# EAGLE design main (EAGLE 9.1.1)
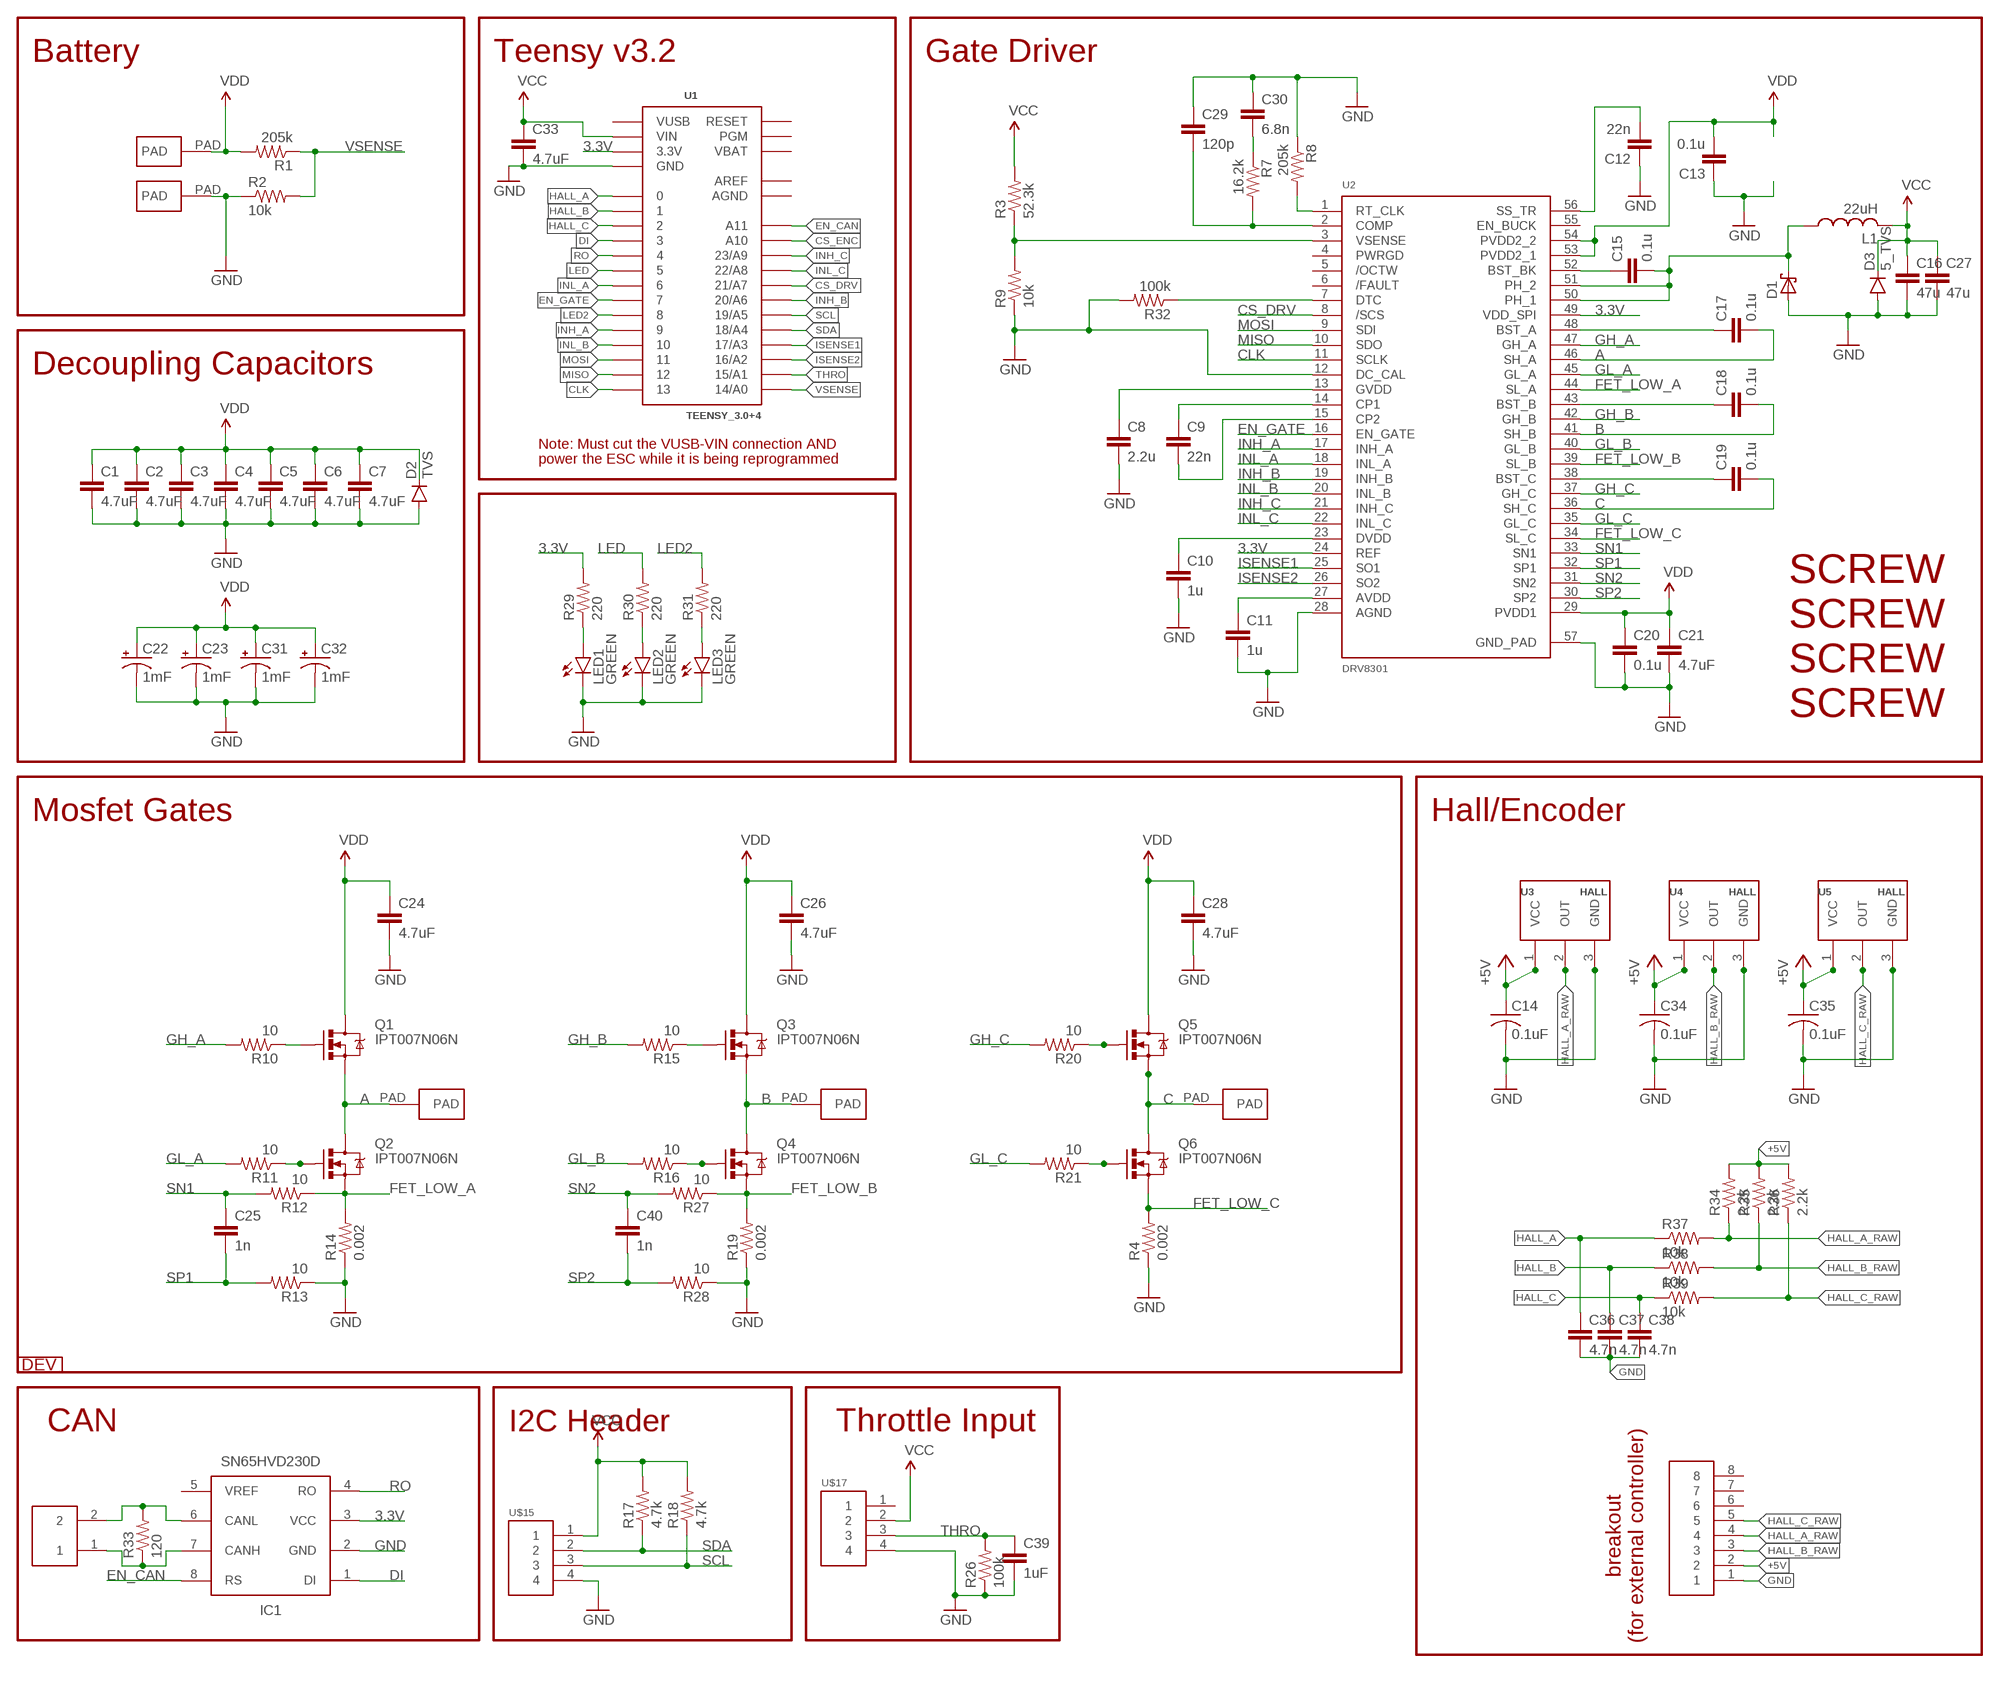
[diagram p0: schematic, sheet 1]

## Parts
C1  4.7uF  CAP1206  [1206]
C2  4.7uF  CAP1206  [1206]
C3  4.7uF  CAP1206  [1206]
C4  4.7uF  CAP1206  [1206]
C5  4.7uF  CAP1206  [1206]
C6  4.7uF  CAP1206  [1206]
C7  4.7uF  CAP1206  [1206]
C8  2.2u  CAP0603-CAP  [0603-CAP]
C9  22n  CAP0603-CAP  [0603-CAP]
C10  1u  CAP0603-CAP  [0603-CAP]
C11  1u  CAP0603-CAP  [0603-CAP]
C12  22n  CAP0603-CAP  [0603-CAP]
C13  0.1u  CAP0603-CAP  [0603-CAP]
C14  0.1uF  C-USC0603  [C0603]
C15  0.1u  CAP0603-CAP  [0603-CAP]
C16  47u  CAP0805  [0805]
C17  0.1u  CAP0603-CAP  [0603-CAP]
C18  0.1u  CAP0603-CAP  [0603-CAP]
C19  0.1u  CAP0603-CAP  [0603-CAP]
C20  0.1u  CAP0603-CAP  [0603-CAP]
C21  4.7uF  CAP1206  [1206]
C22  1mF  CAP_POLPTH4_3D  [CAPPRD508W65D1275H3100B]
C23  1mF  CAP_POLPTH4_3D  [CAPPRD508W65D1275H3100B]
C24  4.7uF  CAP1206  [1206]
C25  1n  CAP0603-CAP  [0603-CAP]
C26  4.7uF  CAP1206  [1206]
C27  47u  CAP0805  [0805]
C28  4.7uF  CAP1206  [1206]
C29  120p  CAP0603-CAP  [0603-CAP]
C30  6.8n  CAP0603-CAP  [0603-CAP]
C31  1mF  CAP_POLPTH4_3D  [CAPPRD508W65D1275H3100B]
C32  1mF  CAP_POLPTH4_3D  [CAPPRD508W65D1275H3100B]
C33  4.7uF  CAP1206  [1206]
C34  0.1uF  C-USC0603  [C0603]
C35  0.1uF  C-USC0603  [C0603]
C36  4.7n  CAP0603-CAP  [0603-CAP]
C37  4.7n  CAP0603-CAP  [0603-CAP]
C38  4.7n  CAP0603-CAP  [0603-CAP]
C39  1uF  CAP0603-CAP  [0603-CAP]
C40  1n  CAP0603-CAP  [0603-CAP]
CAN  HEADER2  [2PINVALULOK]
D1  SCHOTTKY_SMA  [SMA]
D2  TVS  DIODEES3J  [SMC]
D3  5_TVS  DIODESOT23  [SOT23-3]
IC1  SN65HVD230D  [SO-8]
L1  22uH  L-USL5650M  [L5650M]
LED1  GREEN  LED1206  [LED-1206]
LED2  GREEN  LED1206  [LED-1206]
LED3  GREEN  LED1206  [LED-1206]
Q1  IPT007N06N  MOSFET-NCHANNELPG-HSOF-8-1  [PG-HSOF-8-1]
Q2  IPT007N06N  MOSFET-NCHANNELPG-HSOF-8-1  [PG-HSOF-8-1]
Q3  IPT007N06N  MOSFET-NCHANNELPG-HSOF-8-1  [PG-HSOF-8-1]
Q4  IPT007N06N  MOSFET-NCHANNELPG-HSOF-8-1  [PG-HSOF-8-1]
Q5  IPT007N06N  MOSFET-NCHANNELPG-HSOF-8-1  [PG-HSOF-8-1]
Q6  IPT007N06N  MOSFET-NCHANNELPG-HSOF-8-1  [PG-HSOF-8-1]
R1  205k  RESISTOR0603-RES  [0603-RES]
R2  10k  RESISTOR0603-RES  [0603-RES]
R3  52.3k  RESISTOR0603-RES  [0603-RES]
R4  0.002  RESISTOR2512  [R2512]
R7  16.2k  RESISTOR0603-RES  [0603-RES]
R8  205k  RESISTOR0603-RES  [0603-RES]
R9  10k  RESISTOR0603-RES  [0603-RES]
R10  10  RESISTOR0603-RES  [0603-RES]
R11  10  RESISTOR0603-RES  [0603-RES]
R12  10  RESISTOR0603-RES  [0603-RES]
R13  10  RESISTOR0603-RES  [0603-RES]
R14  0.002  RESISTOR2512  [R2512]
R15  10  RESISTOR0603-RES  [0603-RES]
R16  10  RESISTOR0603-RES  [0603-RES]
R17  4.7k  RESISTOR0603-RES  [0603-RES]
R18  4.7k  RESISTOR0603-RES  [0603-RES]
R19  0.002  RESISTOR2512  [R2512]
R20  10  RESISTOR0603-RES  [0603-RES]
R21  10  RESISTOR0603-RES  [0603-RES]
R26  100k  RESISTOR0603-RES  [0603-RES]
R27  10  RESISTOR0603-RES  [0603-RES]
R28  10  RESISTOR0603-RES  [0603-RES]
R29  220  RESISTOR0603-RES  [0603-RES]
R30  220  RESISTOR0603-RES  [0603-RES]
R31  220  RESISTOR0603-RES  [0603-RES]
R32  100k  RESISTOR0603-RES  [0603-RES]
R33  120  RESISTOR0603-RES  [0603-RES]
R34  2.2k  RESISTOR0603-RES  [0603-RES]
R35  2.2k  RESISTOR0603-RES  [0603-RES]
R36  2.2k  RESISTOR0603-RES  [0603-RES]
R37  10k  RESISTOR0603-RES  [0603-RES]
R38  10k  RESISTOR0603-RES  [0603-RES]
R39  10k  RESISTOR0603-RES  [0603-RES]
U1  TEENSY_3.0+4  [TEENSY_3.0+4]
U2  DRV8301  [DRV8301]
U3  HALLSOT23W  [SOT23W]
U4  HALLSOT23W  [SOT23W]
U5  HALLSOT23W  [SOT23W]
U$15  HEADER4VALULOK  [4PINVALULOK]
U$16  DEV  [DEV]
U$17  HEADER4VALULOK  [4PINVALULOK]
U$19  SCREW  [M3HOLE]
U$20  SCREW  [M3HOLE]
U$21  SCREW  [M3HOLE]
U$22  SCREW  [M3HOLE]
U$23  PAD  [PAD]
U$24  PAD  [PAD]
U$25  PAD  [PAD]
U$26  PAD  [PAD]
U$27  PAD  [PAD]
U$29  HEADER8  [8PINVALULOK]

## Nets
3.3V: IC1.3(VCC) R29.2 U1.3.3V U1.3.3V1(3.3V) U2.24(REF) U2.49(VDD_SPI)
+5V: C14.1 C34.1 C35.1 R34.2 R35.2 R36.2 U3.1(VCC) U4.1(VCC) U5.1(VCC) U$29.2
A: C17.2 Q1.S Q2.D U2.46(SH_A) U$23.PAD
B: C18.2 Q3.S Q4.D U2.41(SH_B) U$24.PAD
C: C19.2 Q5.S Q6.D U2.36(SH_C) U$25.PAD
CANH: CAN.1 IC1.7(CANH) R33.1
CANL: CAN.2 IC1.6(CANL) R33.2
CLK: U1.13 U2.11(SCLK)
CS_DRV: U1.21/A7 U2.8(/SCS)
CS_ENC: U1.A10
DI: IC1.1(DI) U1.3
EN_CAN: IC1.8(RS) U1.A11
EN_GATE: U1.7 U2.16(EN_GATE)
FET_LOW_A: Q2.S R12.1 R14.2 U2.44(SL_A)
FET_LOW_B: Q4.S R19.2 R27.1 U2.39(SL_B)
FET_LOW_C: Q6.S R4.2 U2.34(SL_C)
GH_A: R10.2 U2.47(GH_A)
GH_B: R15.2 U2.42(GH_B)
GH_C: R20.2 U2.37(GH_C)
GL_A: R11.2 U2.45(GL_A)
GL_A': Q2.G R11.1
GL_B: R16.2 U2.40(GL_B)
GL_B': Q4.G R16.1
GL_C: R21.2 U2.35(GL_C)
GL_C': Q6.G R21.1
GND: C1.2 C2.2 C3.2 C4.2 C5.2 C6.2 C7.2 C8.2 C10.2 C11.2 C12.1 C13.1 C14.2 C16.2 C20.2 C21.2 C22.- C23.- C24.2 C26.2 C27.2 C28.2 C29.1 C30.1 C31.- C32.- C33.2 C34.2 C35.2 C36.2 C37.2 C38.2 C39.2 D1.A D2.A D3.1(A) IC1.2(GND) LED1.C LED2.C LED3.C R2.1 R4.1 R8.1 R9.1 R13.1 R14.1 R19.1 R26.1 R28.1 R32.2 U1.GND U1.GND1(GND) U2.12(DC_CAL) U2.28(AGND) U2.57(GND_PAD) U3.3(GND) U4.3(GND) U5.3(GND) U$15.4 U$17.4 U$27.PAD U$29.1
HALL_A: C36.1 R37.1 U1.0
HALL_A_RAW: R34.1 R37.2 U3.2(OUT) U$29.4
HALL_B: C37.1 R38.1 U1.1
HALL_B_RAW: R35.1 R38.2 U4.2(OUT) U$29.3
HALL_C: C38.1 R39.1 U1.2
HALL_C_RAW: R36.1 R39.2 U5.2(OUT) U$29.5
INH_A: U1.9 U2.17(INH_A)
INH_B: U1.20/A6 U2.19(INH_B)
INH_C: U1.23/A9 U2.21(INH_C)
INL_A: U1.6 U2.18(INL_A)
INL_B: U1.10 U2.20(INL_B)
INL_C: U1.22/A8 U2.22(INL_C)
ISENSE1: U1.17/A3 U2.25(SO1)
ISENSE2: U1.16/A2 U2.26(SO2)
LED: R30.2 U1.5
LED2: R31.2 U1.8
MISO: U1.12 U2.10(SDO)
MOSI: U1.11 U2.9(SDI)
N$1: Q3.G R15.1
N$2: R3.1 R9.2 U2.3(VSENSE)
N$3: C29.2 R7.2 U2.2(COMP)
N$4: C10.1 U2.23(DVDD)
N$5: Q5.G R20.1
N$6: C12.2 U2.56(SS_TR)
N$7: C30.2 R7.1
N$8: C15.1 U2.52(BST_BK)
N$9: Q1.G R10.1
N$10: R8.2 U2.1(RT_CLK)
N$11: LED1.A R29.1
N$12: R32.1 U2.7(DTC)
N$16: LED2.A R30.1
N$17: LED3.A R31.1
N$28: C19.1 U2.38(BST_C)
N$30: C9.1 U2.14(CP1)
N$31: C11.1 U2.27(AVDD)
N$32: C9.2 U2.15(CP2)
N$33: C8.1 U2.13(GVDD)
N$34: C18.1 U2.43(BST_B)
N$44: C17.1 U2.48(BST_A)
N$47: C15.2 D1.C L1.1 U2.50(PH_1) U2.51(PH_2)
RO: IC1.4(RO) U1.4
SCL: R18.1 U1.19/A5 U$15.3
SDA: R17.1 U1.18/A4 U$15.2
SN1: C25.1 R12.2 U2.33(SN1)
SN2: C40.1 R27.2 U2.31(SN2)
SP1: C25.2 R13.2 U2.32(SP1)
SP2: C40.2 R28.2 U2.30(SP2)
THRO: C39.1 R26.2 U1.15/A1 U$17.3
VCC: C16.1 C27.1 C33.1 D3.3(C) L1.2 R3.2 R17.2 R18.2 U1.VIN U$15.1 U$17.2
VDD: C1.1 C2.1 C3.1 C4.1 C5.1 C6.1 C7.1 C13.2 C20.1 C21.1 C22.+ C23.+ C24.1 C26.1 C28.1 C31.+ C32.+ D2.C Q1.D Q3.D Q5.D R1.2 U2.29(PVDD1) U2.53(PVDD2_1) U2.54(PVDD2_2) U$26.PAD
VSENSE: R1.1 R2.2 U1.14/A0
Unconnected: IC1.5(VREF) U1.PGM U1.RESET U2.4(PWRGD) U2.5(/OCTW) U2.6(/FAULT) U2.55(EN_BUCK) U$17.1 U$29.6 U$29.7 U$29.8

## Notes on the sheet
- Battery | Teensy v3.2 | Gate Driver
- Decoupling Capacitors
- Note: Must cut the VUSB-VIN connection AND
- power the ESC while it is being reprogrammed
- Mosfet Gates | Hall/Encoder
- CAN | I2C Header | Throttle Input
- breakout
  (for external controller)

## Power pins joined to a net without a drawn wire
AGND: U1.AGND
AREF: U1.AREF
VBAT: U1.VBAT
VUSB: U1.VUSB

## Library data of the parts
C1-C7 C10 C11 C16 C21 C24 C26-C28 C33 = SparkFun-Capacitors:CAP: Capacitor Standard 0603 ceramic capacitor, and 0.1" leaded capacitor.
C8 C9 C12 C13 C15 C17-C20 C25 C29 C30 C36-C40 = SparkFun-Passives:CAP: Capacitor Standard 0603 ceramic capacitor, and 0.1" leaded capacitor.
C14 C34 C35 = rcl:C-US: CAPACITOR, American symbol
C22 C23 C31 C32 = SparkFun-Capacitors:CAP_POL: Capacitor Polarized These are standard SMD and PTH capacitors. Normally 10uF, 47uF, and 100uF in electrolytic and tantalum varieties. Always verify the external diameter of the through hole cap, it varies with capacity, voltage, and manufacturer. The EIA devices should be standard.
CAN = Custom_old:HEADER2
D1 = sc_usercreated:SCHOTTKY_SMA
D2 = SparkFun-DiscreteSemi:DIODE: Diode These are standard reverse protection diodes and small signal diodes. SMA package can handle up to about 1A. SOD-323 can handle about 200mA. What the SOD-323 package when ordering, there are some mfgs out there that are 5-pin packages.; PROD_ID: DIO-12441; VALUE: 3A/600V
D3 = SparkFun-DiscreteSemi:DIODE: Diode These are standard reverse protection diodes and small signal diodes. SMA package can handle up to about 1A. SOD-323 can handle about 200mA. What the SOD-323 package when ordering, there are some mfgs out there that are 5-pin packages.
IC1 = Misaka-IC:SN65HVD23*D: 3.3V CAN Bus Transceiver Supply voltage: 3...3.6V Max rate: 1Mbps Standby mode(SN65HVD230D) Sleep mode(SN65HVD231D) Slope control mode
L1 = rcl:L-US: INDUCTOR, American symbol; SPICEPREFIX: L
LED1-LED3 = SparkFun-LED:LED: LEDs Standard schematic elements and footprints for 5mm, 3mm, 1206, and 0603 sized LEDs. 5mm - Spark Fun Electronics SKU : COM-00529 (and others)
Q1-Q6 = Custom_old:MOSFET-NCHANNEL: Generic NMOS footprint
R1-R3 R7-R13 R15-R18 R20 R21 R26-R39 = SparkFun-Passives:RESISTOR: Resistor Basic schematic elements and footprints for 0603, 1206, and PTH resistors.
R4 R14 R19 = SparkFun-Resistors:RESISTOR: Resistor Basic schematic elements and footprints for 0603, 1206, and PTH resistors.
U1 = Teensy3.0:TEENSY_3.0+4: Teensy 3.0 board, showing all pins that are easily acessible. See 'AllAnalogPins" and 'AllPins' packages for additional pin holes, as needed. The 'Basic' package has fewer pins.
U2 = F-J:DRV8301
U3-U5 = Custom_new:HALL
U$15 U$17 = Custom_old:HEADER4
U$16 = F-J:DEV
U$19-U$22 = Custom_old:SCREW
U$23-U$27 = Custom_old:PAD
U$29 = Custom_old:HEADER8

## Module 2/2
Ports: 

### Library data of the parts

## Board
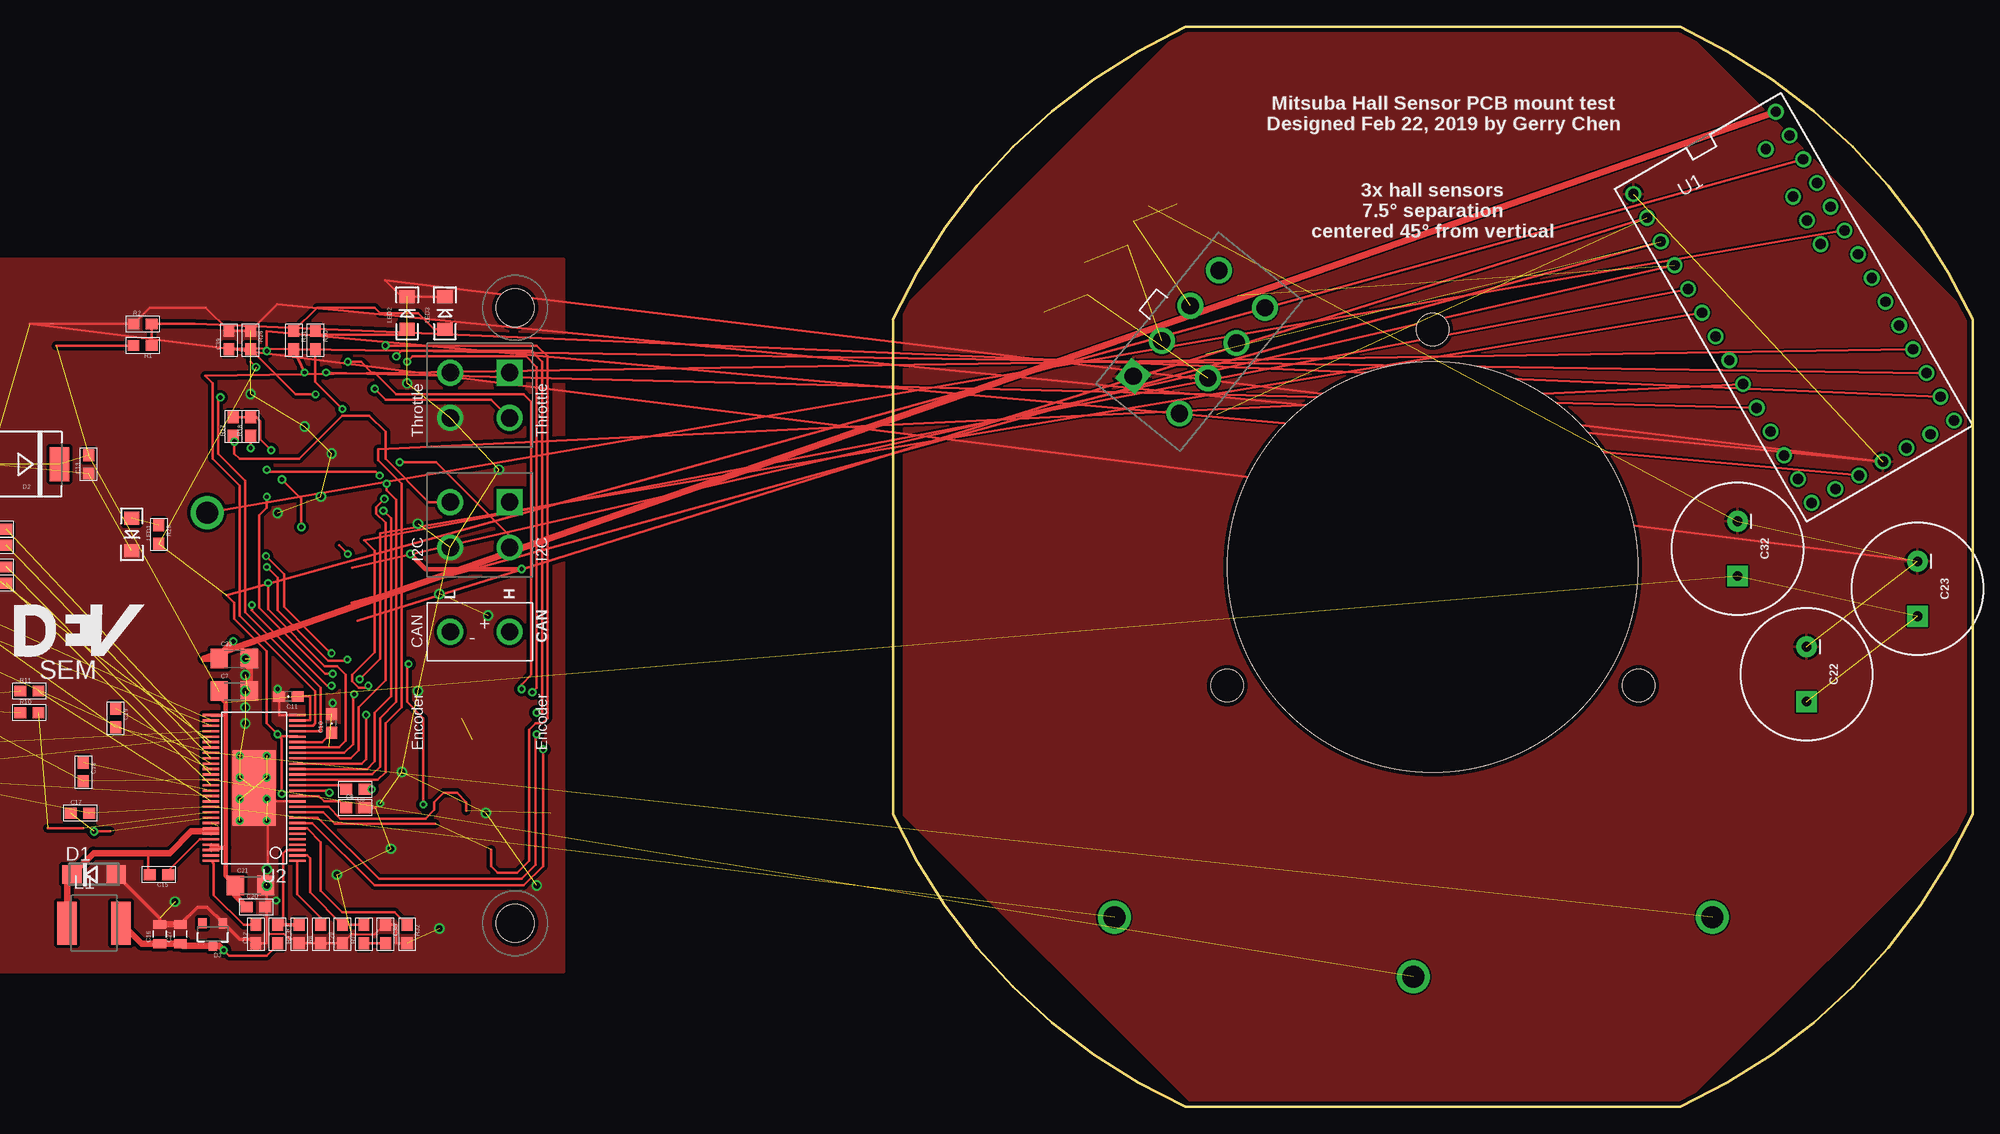
[diagram p1: board, top side]
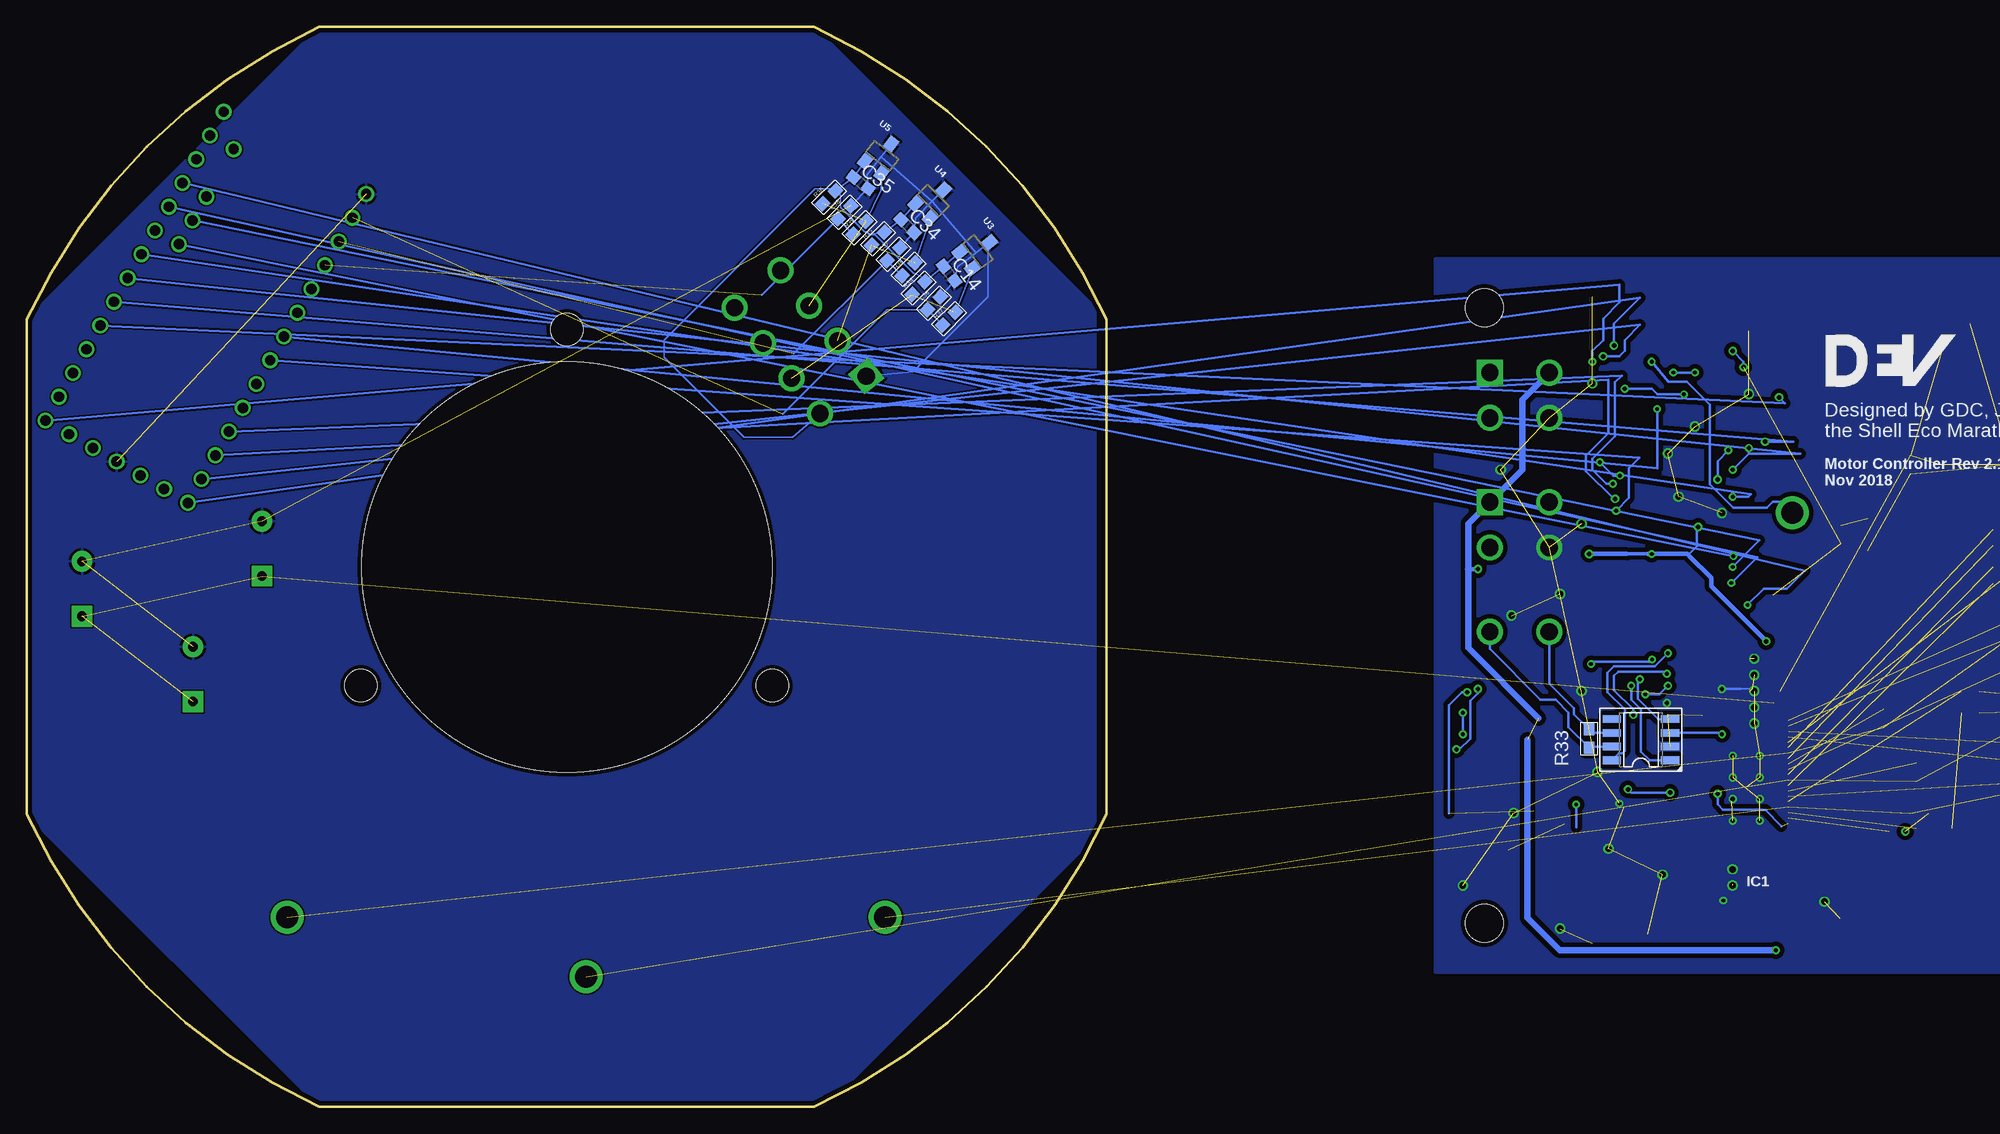
[diagram p2: board, bottom side, seen from below]

Size 100 x 100 mm. Coordinates in mm from the lower left corner, seen from the top.
Outline: 72.91,100 27.09,100 arc41 0,72.91 0,27.09 arc41 27.09,0 72.91,0 arc41 100,27.09 100,72.91 arc41 72.91,100
Copper layers (1*16): Top 0.0356mm / dielectric 1.5011mm / Bottom 0.0356mm
Design rules "patrick *": minimum track width 6mil, minimum drill 13mil, track to track 6mil, track to pad 6mil, pad to pad 6mil, via to via 6mil, smd to smd 6mil, copper to edge 15mil, drill to drill 6mil, minimum pad ring 7mil, minimum via ring 7mil, stop-mask expansion 3mil, vias tented up to drill 30mil, thermal gap 10mil
Holes 3 mm at 30.95,39 69.05,39 50,72
Holes 38 mm at 50,50

### Footprints (pad centres in the part's own frame; a part is rotated, then mirrored left to right if it is on the bottom)
1206 = smd 1.6 x 1.8: 1 -1.4,0; 2 1.4,0
0603-CAP = smd 1.1 x 1: 1 -0.85,0; 2 0.85,0
C0603 = smd 1.1 x 1: 1 -0.85,0; 2 0.85,0
0805 = smd 0.8 x 1.2: 1 -0.9,0; 2 0.9,0
CAPPRD508W65D1275H3100B = drill 0.9 pad 1.93 square: + 2.54,0 | drill 0.9 pad 1.93: - -2.54,0
2PINVALULOK = drill 1.6: 1 0,5.5; 2 0,0
SMA = smd 1.8 x 1.7: A 2.05,0; C -2.05,0
SMC = smd 1.778 x 3.175: A 3.302,0; C -3.302,0
SOT23-3 = smd 0.8 x 0.9: 1 -0.95,-1; 2 0.95,-1; 3 0,1.1
SO-8 = smd 1.7 x 0.7: 1 -2.7,1.905; 2 -2.7,0.635; 3 -2.7,-0.635; 4 -2.7,-1.905; 5 2.7,-1.905; 6 2.7,-0.635; 7 2.7,0.635; 8 2.7,1.905
L5650M = smd 1.8 x 4: 1 -2.5,0; 2 2.5,0
LED-1206 = smd 1.2 x 1.4: A -1.5,0; C 1.5,0
PG-HSOF-8-1 = smd 7.5 x 7.65: D 0,8.855 | smd 0.8 x 3: G -4.2,0.5 | smd 8 x 3: S 0.6,0.5
0603-RES = smd 1.1 x 1: 1 -0.85,0; 2 0.85,0
R2512 = smd 1.8 x 3.2: 1 -2.8,0; 2 2.8,0
TEENSY_3.0+4 = drill 0.965: 0 -7.62,13.97; 1 -7.62,11.43; 2 -7.62,8.89; 3 -7.62,6.35; 3.3V 7.62,11.43; 3.3V1 -2.54,-16.51; 4 -7.62,3.81; 5 -7.62,1.27; 6 -7.62,-1.27; 7 -7.62,-3.81; 8 -7.62,-6.35; 9 -7.62,-8.89; 10 -7.62,-11.43; 11 -7.62,-13.97; 12 -7.62,-16.51; 13 7.62,-16.51; 14/A0 7.62,-13.97; 15/A1 7.62,-11.43; 16/A2 7.62,-8.89; 17/A3 7.62,-6.35; 18/A4 7.62,-3.81; 19/A5 7.62,-1.27; 20/A6 7.62,1.27; 21/A7 7.62,3.81; 22/A8 7.62,6.35; 23/A9 7.62,8.89; A10 5.08,6.35; A11 5.08,3.81; AGND 7.62,13.97; AREF 5.08,8.89; GND -7.62,16.51; GND1 0,-16.51; PGM 2.54,-16.51; RESET 5.08,-16.51; VBAT -5.08,-16.51; VIN 7.62,16.51; VUSB 5.08,13.97
DRV8301 = smd 1.5 x 0.21: 1 -4,6.75; 2 -4,6.25; 3 -4,5.75; 4 -4,5.25; 5 -4,4.75; 6 -4,4.25; 7 -4,3.75; 8 -4,3.25; 9 -4,2.75; 10 -4,2.25; 11 -4,1.75; 12 -4,1.25; 13 -4,0.75; 14 -4,0.25; 15 -4,-0.25; 16 -4,-0.75; 17 -4,-1.25; 18 -4,-1.75; 19 -4,-2.25; 20 -4,-2.75; 21 -4,-3.25; 22 -4,-3.75; 23 -4,-4.25; 24 -4,-4.75; 25 -4,-5.25; 26 -4,-5.75; 27 -4,-6.25; 28 -4,-6.75; 29 4,-6.75; 30 4,-6.25; 31 4,-5.75; 32 4,-5.25; 33 4,-4.75; 34 4,-4.25; 35 4,-3.75; 36 4,-3.25; 37 4,-2.75; 38 4,-2.25; 39 4,-1.75; 40 4,-1.25; 41 4,-0.75; 42 4,-0.25; 43 4,0.25; 44 4,0.75; 45 4,1.25; 46 4,1.75; 47 4,2.25; 48 4,2.75; 49 4,3.25; 50 4,3.75; 51 4,4.25; 52 4,4.75; 53 4,5.25; 54 4,5.75; 55 4,6.25; 56 4,6.75 | smd 4 x 7: 57 0,0
SOT23W = smd 1 x 1.4: 1 -0.95,-1.303; 2 0.95,-1.303; 3 0,1.303
4PINVALULOK = drill 1.6 square: 1 0,5.5 | drill 1.6: 2 0,0; 3 4.2,5.5; 4 4.2,0
M3HOLE = hole 3.5: 0,0
PAD = smd 10.16 x 5.08: PAD 0,0
8PINVALULOK = drill 1.6 square: 1 0,5.5 | drill 1.6: 2 0,0; 3 4.2,5.5; 4 4.2,0; 5 8.4,5.5; 6 8.4,0; 7 12.6,5.5; 8 12.6,0

### Placement (x,y rotation side)
C1  -89,47.5 0 top  (outside the outline)
C2  -89,59.5 0 top  (outside the outline)
C3  -89,54.5 0 top  (outside the outline)
C4  -89,35.5 0 top  (outside the outline)
C5  -89,45 0 top  (outside the outline)
C6  -89,30.5 0 top  (outside the outline)
C7  -61,38.5 0 top  (outside the outline)
C8  -49.8,27.7 0 top  (outside the outline)
C9  -49.8,29.4 180 top  (outside the outline)
C10  -52,35.5 90 top  (outside the outline)
C11  -56,38 180 top  (outside the outline)
C12  -59,16 90 top  (outside the outline)
C13  -74.5,59.5 90 top  (outside the outline)
C14  14.58,77.18 307.5 bottom
C15  -68,21.5 180 top  (outside the outline)
C16  -67.9,16 90 top  (outside the outline)
C17  -75.3,27.2 0 top  (outside the outline)
C18  -75,31 270 top  (outside the outline)
C19  -72,36 270 top  (outside the outline)
C20  -59,18.5 0 top  (outside the outline)
C21  -59.5,20.5 0 top  (outside the outline)
C22  84.63,40.07 270 top
C23  94.9,47.97 270 top
C24  -89,57 0 top  (outside the outline)
C25  -85,32.8 90 top  (outside the outline)
C26  -89,42.5 0 top  (outside the outline)
C27  -66,16 90 top  (outside the outline)
C28  -89,33 0 top  (outside the outline)
C29  -51,16 90 top  (outside the outline)
C30  -47,16 270 top  (outside the outline)
C31  -100,20 90 top  (outside the outline)
C32  78.23,51.7 270 top
C33  -61,41.5 0 top  (outside the outline)
C34  18.43,81.57 315 bottom
C35  22.78,85.57 322.5 bottom
C36  16,74.41 45 bottom
C37  19.74,78.97 45 bottom
C38  24.29,82.83 45 bottom
C39  -61.5,71 90 top  (outside the outline)
C40  -85.38,44.97 90 top  (outside the outline)
CAN  -41,44 270 top  (outside the outline)
D1  -74,21.5 0 top  (outside the outline)
D2  -80.5,59.5 180 top  (outside the outline)
D3  -63,16 180 top  (outside the outline)
IC1  -49.5,34 180 bottom  (outside the outline)
L1  -74,17 0 top  (outside the outline)
LED1  -70.5,53 270 top  (outside the outline)
LED2  -45,73.5 90 top  (outside the outline)
LED3  -41.5,73.5 90 top  (outside the outline)
Q1  -105,33 270 top  (outside the outline)
Q2  -94,33 270 bottom  (outside the outline)
Q3  -105,45 270 top  (outside the outline)
Q4  -94,45 270 bottom  (outside the outline)
Q5  -105,57 270 top  (outside the outline)
Q6  -94,57 270 bottom  (outside the outline)
R1  -69.5,70.5 180 top  (outside the outline)
R2  -69.5,72.5 0 top  (outside the outline)
R3  -57,16 270 top  (outside the outline)
R4  -90,57 270 bottom  (outside the outline)
R7  -49,16 90 top  (outside the outline)
R8  -53,16 90 top  (outside the outline)
R9  -55,16 90 top  (outside the outline)
R10  -80,36.5 0 top  (outside the outline)
R11  -80,38.5 0 top  (outside the outline)
R12  -86.5,31 90 bottom  (outside the outline)
R13  -86.5,34.5 270 bottom  (outside the outline)
R14  -90,33 270 bottom  (outside the outline)
R15  -83,48.5 0 top  (outside the outline)
R16  -83,50 0 top  (outside the outline)
R17  -61.1,63 90 top  (outside the outline)
R18  -59.5,63 90 top  (outside the outline)
R19  -90,45 270 bottom  (outside the outline)
R20  -83,52 0 top  (outside the outline)
R21  -83,53.5 0 top  (outside the outline)
R26  -59.5,71 270 top  (outside the outline)
R27  -87,43 90 bottom  (outside the outline)
R28  -87,46.5 270 bottom  (outside the outline)
R29  -68,53 270 top  (outside the outline)
R30  -53.5,71 270 top  (outside the outline)
R31  -55.5,71 270 top  (outside the outline)
R32  -45,16 270 top  (outside the outline)
R33  -44.7,34.1 90 bottom  (outside the outline)
R34  17.41,75.83 45 bottom
R35  21.16,80.39 45 bottom
R36  25.7,84.24 45 bottom
R37  14.59,73 45 bottom
R38  18.33,77.56 45 bottom
R39  22.87,81.41 45 bottom
U1  83.44,74.04 30 top
U2  -59.17,29.53 180 top  (outside the outline)
U3  11.92,79.22 307.5 bottom
U4  16.06,83.94 315 bottom
U5  20.78,88.08 322.5 bottom
U$15  -41,56 270 top  (outside the outline)
U$16  -81.35,41.74 0 top  (outside the outline)
U$17  -41,68 270 top  (outside the outline)
U$19  -112,17 0 top  (outside the outline)
U$20  -35,17 0 top  (outside the outline)
U$21  -112,74 0 top  (outside the outline)
U$22  -35,74 0 top  (outside the outline)
U$23  -111,33 90 top  (outside the outline)
U$24  -111,45 90 top  (outside the outline)
U$25  -111,57 90 top  (outside the outline)
U$26  -108,67 0 top  (outside the outline)
U$27  -108,67 0 bottom  (outside the outline)
U$28  DEV  [DEV]  -66.65,66.74 0 bottom  (outside the outline)
U$29  26.53,64.2 51 top
U$30  [DEV]  7,60 0 top
U$31  [DEV]  79,51 0 top

### Tracks (layer width: path | path; a pad name or v marks a point on that pad's centre or on a via)
3.3V  (via drill 0.35, 0.4)  (3 unrouted)
  Top 0.254: U2.24 -55.19,34.3 -56.8,34.3 | -56.8,34.3 v-57,34.5 -58,35.5 -58,42.2 -61,45.2 -61,46.7 -61.7,47.4 U1.3.3V | -56.8,34.3 -56.6,34.1 v-56.6,29 | U1.3.3V1 -58,71.84 v-58,70 | v-59,68.5 -59.5,69
  Bottom 0.254: -62.5,26 -61,27.5 -57.1,27.5 -56.6,28 v-56.6,29 | v-58,70 -59,69 v-59,68.5 | IC1.3 -56.86,34.63 v-57,34.5
+5V
  Bottom 0.152: U3.1 C14.1 16.64,76.57 | 16.64,76.57 R34.2 | U4.1 C34.1 R35.2 21.98,80.8 | U5.1 C35.1 R36.2 | R36.2 24.66,84.4 24.66,83.3 22.4,81.05 22.25,81.05 22,80.8 21.98,80.8 | 21.98,80.8 21.93,80.76 21.43,80.76 17.86,77.19 17.8,77.19 16.64,76.57 | U$29.2 29.09,62 33.59,62 41,69.41 41,71 27,85 25.25,85 R36.2
A  (via drill 2.03)  (4 unrouted)
  other vias: 20.5,17.54
  pour Top (isolate 0.254, no thermals): -114,28 -114,38 -108,38 -106,36 -101,36 -101,28
B  (via drill 2.03)  (4 unrouted)
  other vias: 48.2,12.04
  pour Top (isolate 0.254, no thermals): -114,50 -114,40 -101,40 -101,48 -106,48 -108,50
C  (via drill 2.03)  (4 unrouted)
  other vias: 75.9,17.54
  pour Top (isolate 0.254, no thermals): -114,62 -114,52 -101,52 -101,60 -106,60 -108,62
CANH
  Bottom 0.254: IC1.7 -44.81,33.36 R33.1 -42.8,35.15 -42.8,36.5 -41.6,37.7 -40.2,37.7 -35.5,42.4 CAN.1
CANL
  Bottom 0.254: IC1.6 -45.02,34.63 R33.2 -43.3,36.35 -43.3,36.9 -41,39.2 CAN.2
CLK  (via drill 0.4)  (1 unrouted)
  Top 0.254: v-45,69 -44.5,69.5 -34,69.5 -33,68.5 -33,38.8 v-33.4,38.4 | U2.11 -52.28,27.78 -51.2,26.7 -43.3,26.7 -42.48,27.52 -42.48,28.21 -41.61,29.08 -40.39,29.08 -39.52,28.21 -39.52,27.42
  Bottom 0.254: U1.13 -47.5,76.15 -47.5,74.5 -46,73 -46,71 -45,70 v-45,69 | -31.7,27.2 -31.7,37.2 -32.9,38.4 v-33.4,38.4
CS_DRV  (via drill 0.35, 0.4, 2.03)
  Top 0.254: U2.8 -53.78,26.28 -48,20.5 -34.2,20.5 -32.4,22.3 v-32.4,33.1 | U1.21/A7 v-63.54,55.02 | v-50.5,69 -49.28,69 -48.28,68 -48,68 -46,66 -34.2,66 -33.5,65.3 -33.5,40 -34.4,39.1 v-34.4,38.7
  Bottom 0.254: v-63.54,55.02 -62.53,56.02 -61.7,56.02 -61.18,55.5 -58.07,55.5 -55.9,57.67 -55.9,65.03 -53.77,67.16 -52.02,67.16 v-50.5,69 | v-34.4,38.7 -34.4,38.3 -33.7,37.6 -33.7,34.1 -32.7,33.1 v-32.4,33.1
CS_ENC  (via drill 0.35)
  Top 0.254: v-58,50 -57,49 -57,46 -52.3,41.3 -50.67,41.3 v-50.54,41.43 | v-43.5,28 -43.5,36 -45,37.5 -45,40.87 v-44.87,41
  Bottom 0.254: U1.A10 -60.48,52.48 v-58,50 | -43.5,25.9 v-43.5,28 | v-44.87,41 -45.07,41.21 -50.33,41.21 -50.54,41.42 v-50.54,41.43
DI  (via drill 0.35)
  Top 0.254: U1.3 -48.98,52.48 -48,51.5 -48,42.1 -50.1,40 -50.1,39.4 -49.5,38.8 -48.8,38.8 v-48.6,39
  Bottom 0.254: v-48.6,39 -48.6,37.7 -49.5,36.8 -49.5,32.9 -50.31,32.09 IC1.1
EN_CAN  (via drill 0.35)
  Top 0.254: v-58.07,51 -56.4,49.33 -56.4,46.3 -52.1,42 v-52,42
  Bottom 0.254: U1.A11 -58.1,51 v-58.07,51 | IC1.8 -47.44,32.74 -47.77,32.74 -48,32.97 -48,36.8 -46.4,38.4 -46.4,40.2 -47,40.8 -50.8,40.8 v-52,42
EN_GATE
  Top 0.254: U2.16 -47.72,30.28 -47,31 -47,35.5 -45.5,37 -45.5,57.7 -47.7,59.9 -47.7,60.92 U1.7
FET_LOW_A  (3 unrouted)
  pour Bottom (isolate 0.254, no thermals): -96,36.5 -96,28.5 -93,32.5 -93,36.5
FET_LOW_B  (3 unrouted)
FET_LOW_C  (2 unrouted)
  pour Bottom (isolate 0.254, no thermals): -96,60 -96,53 -93,56 -93,60
GH_A  (2 unrouted)
  Top 0.254: -78.3,25.8 -75,25.8
GH_B  (1 unrouted)
GH_C  (1 unrouted)
GL_A  (1 unrouted)
GL_A'  (1 unrouted)
GL_B  (1 unrouted)
GL_B'  (1 unrouted)
GL_C  (1 unrouted)
GL_C'  (1 unrouted)
GND  (via drill 0.35, 0.4, 0.6)  (61 unrouted)
  Top 0.2: -50,16 -48,16 | R9.1 -55.35,15.5 -55.9,15.5 -56.4,16 -58,16
  Top 0.254: U2.12 -57.78,28.28 | -57.78,28.28 -57.92,28.28 | -57.92,28.28 U2.57 | -57.92,28.28 -57.92,20.68 C21.2 | C12.1 -58,15.15 -58,16 -58,18.5 | -58,18.5 -58,19 | -58,19 -58,20 -58.1,20 C21.2 | LED3.C LED2.C -45.5,75 -47.04,76.54 U1.GND1 -57.04,74.31 R26.1 C39.2 -63.65,74 -68.85,74 R2.1 -79.96,72.5 C23.- | C10.2 -52,37.3 v-51.9,37.4 | U2.28 -56.85,36.28 C11.2 -57,38 v-57,38.7 | R9.1 R8.1 C29.1 -50.15,16 -50,16 | R32.2 -46,15.15 -46,16.85 C30.1 -47.15,16.85 -48,16 | C20.2 -58,18.5 | v-58,28.5 -57.78,28.28 | C8.2 -47.9,27.7 v-47.5,28.1 | -58,19 -57.9,19.1 v-57.13,19.1 | C21.2 -58,20.6 v-58,22
  Top 0.305: D1.A -67.9,17.45 C16.2 | C27.2 -64.4,18.5 -63.5,18.5 -62.05,17.05 D3.1 -62,17 -60.5,15.5 -59.35,15.5 C12.1
  Top 0.61: C16.2 C27.2 | C33.2 C7.2
  Bottom 0.152: -58.7,38.7 -59.8,38.7 v-60,38.5 | U3.3 10.96,79.95 | 10.96,79.95 12.08,79.1 | 12.08,79.1 12.6,78.7 13.8,77.8 C14.2 C36.2 | C38.2 C35.2 22.2,86.3 20.88,87.98 | C37.2 C34.2 17.7,82.3 16.15,83.85 | U4.3 16.15,83.85 | U5.3 20.88,87.98 | 12.08,79.1 16.15,83.85 | 16.15,83.85 20.88,87.98 | U$29.1 17.92,68.08 10.96,75.04 10.96,79.95
  Bottom 0.254: v-57,38.7 -58.7,38.7
  other vias: -60.5,32.5 -60.5,30.5 -60.5,28.5 -60.5,26.5 -58,26.5 -58,30.5 -58,32.5 -53,56.5 -57,55 -54.5,63 -59.5,66 -60,41.5 -60,40 -60,37 -60,35.5 -51.5,21.5 -33,20.5 -46.5,23.9 -42,16.5 -37.7,27.2 -45.5,31 -44,38.5 -37.5,45.5 -42,47.5 -52,60.5 -44,54 -45,67 -36.5,59 -66.5,19 -58,20.5
  pour Bottom (isolate 0.406, rank 6, no thermals): -116.5,78.5 -116.5,12.5 -30.5,12.5 -30.5,78.5
  pour Top (isolate 0.305, rank 3, no thermals): -116.5,12.5 -30.5,12.5 -30.5,78.5 -116.5,78.5
  pour Top: 1,27 1,74 27,100 73,100 100,73 100,27 73,0 28,0
  pour Top: 1,27 1,74 27,100 73,100 100,73 100,27 73,0 28,0
  pour Bottom: 1,25 1,74 27,100 73,100 100,73 100,27 73,0 26,0
HALL_A  (1 unrouted)
  Top 0.254: -49.56,45 U1.0
  Bottom 0.152: R37.1 15.39,72.61 C36.1 20.35,73.81 30,64.16
HALL_A_RAW  (2 unrouted)
  Bottom 0.152: U3.2 R37.2
HALL_B  (1 unrouted)
  Top 0.254: -50.12,46.7 U1.1
  Bottom 0.152: R38.1 18.99,77.01 C37.1 28.98,69.73
HALL_B_RAW  (2 unrouted)
  Bottom 0.152: U4.2 R38.2
HALL_C  (1 unrouted)
  Top 0.254: -50.11,49.94 U1.2
  Bottom 0.152: R39.1 C38.1 31.95,75.16
HALL_C_RAW  (2 unrouted)
  Bottom 0.152: U5.2 20.9,84.9 R39.2
INH_A  (via drill 0.35)
  Top 0.254: U2.17 -48.22,30.78 -47.5,31.5 -47.5,36 -46,37.5 -46,56.2 -46.9,57.1 v-46.9,57.7
  Bottom 0.254: v-46.9,57.7 -46.3,57.7 -45,59 -45,60 -47.1,62.1 -47.1,67.1 -47.72,67.72 U1.9
INH_B  (via drill 0.35, 0.4)
  Top 0.254: U2.19 -49.22,31.78 -48.8,32.2 v-48.8,36.3 | v-51.9,40.1 -52.6,40.1 -58.7,46.2 -58.7,54.8 -58,55.5 v-58,56.5
  Bottom 0.254: v-58,56.5 -59.42,56.5 -59.67,56.74 U1.20/A6 | v-51.9,40.1 -51.7,40.3 -47.4,40.3 -47,39.9 -47,38.6 -48.8,36.8 v-48.8,36.3
INH_C  (via drill 0.35, 0.4)
  Top 0.254: U2.21 -50.82,32.78 -50,33.6 -50,38.1 v-49.9,38.2 | v-52,39 -52.4,39 -59.4,46 -59.37,46 v-59.37,46.47
  Bottom 0.254: v-49.9,38.2 -51.2,38.2 v-52,39 | v-59.37,46.47 -60.89,48 -63,48 -64.66,49.66 U1.23/A9
INL_A  (via drill 0.4)
  Top 0.254: U2.18 -48.72,31.28 -48,32 -48,36.5 -46.5,38 -46.5,54.5 v-47.2,55.2
  Bottom 0.254: v-47.2,55.2 -48.4,56.4 -48.4,59.16 -49.34,60.1 U1.6
INL_B  (via drill 0.4)
  Top 0.254: U2.20 -50.22,32.28 -49.5,33 -49.5,37 -47,39.5 -47,54.07 -47.86,54.93 -47.86,55.54 v-47.1,56.3
  Bottom 0.254: U1.10 -46.5,67.34 -46.5,62.4 -44.4,60.3 -44.4,58.87 -46.97,56.3 v-47.1,56.3
INL_C  (via drill 0.35)
  Top 0.254: U2.22 -51.32,33.28 -50.7,33.9 -50.7,40.02 -51.5,40.82 -52.62,40.82 -57.87,46.07 v-57.87,48.5
  Bottom 0.254: v-57.87,48.5 -60.27,50.91 U1.22/A8
ISENSE1  (via drill 0.4)
  Top 0.254: U2.25 -53,34.78 -53,38.8 -60,45.8 -60,58 -62.5,60.5 -62.5,65.5 v-62.3,65.7
  Bottom 0.254: v-62.3,65.7 -62.82,65.18 U1.17/A3
ISENSE2
  Top 0.254: U2.26 -53.72,35.28 -53.5,35.5 -53.5,38.5 -60.5,45.5 -60.5,57.5 -63,60 -63,67 -63.72,67.72 U1.16/A2
LED  (via drill 0.35)
  Top 0.254: v-51,64.63 -53.5,67.13 R30.2
  Bottom 0.254: U1.5 -51,59.14 v-51,64.63
LED2  (via drill 0.35)
  Top 0.254: R31.2 v-54.5,68 | v-52.5,68 U1.8
  Bottom 0.254: v-54.5,68 v-52.5,68
MISO  (via drill 0.4)  (1 unrouted)
  Top 0.254: v-47,70.5 -33,70.5 -32,69.5 -32,36 -32.5,35.5 -33.1,35.5 -33.7,34.9 -33.7,22.8 -34.8,21.7 -36.6,21.7 -37.2,22.3 -37.2,23.8 | U2.10 -52.78,27.28 -51.7,26.2 -42.4,26.2
  Bottom 0.254: U1.12 -49.42,74.92 -47,72.5 v-47,70.5
MOSI  (via drill 0.4)
  Top 0.254: v-46,69.5 -45.5,70 -33.5,70 -32.5,69 -32.5,36.5 v-33,36.5 | U2.9 -53.28,26.78 -47.6,21.1 -34.4,21.1 -33.1,22.4 -33.1,34.4 v-33,34.5
  Bottom 0.254: U1.11 -49.42,72.42 -48,71 -48,70 -47.5,69.5 v-46,69.5 | v-33,36.5 v-33,34.5
N$1  (1 unrouted)
N$2
  Top 0.254: U2.3 -56.22,23.78 -56.5,23.5 -56.5,16.85
  Top 0.305: R3.1 -56.5,16.85 R9.2
N$3
  Top 0.254: R7.2 C29.2 -54,19.85 -54,23 -54.28,23.28 U2.2
N$4
  Top 0.254: U2.23 -52.87,33.78 C10.1
N$5  (1 unrouted)
N$6
  Top 0.254: C12.2 -60.15,16.85 -62.9,19.6 -62.9,22.51 U2.56
N$7
  Top 0.254: R7.1 C30.2
N$8
  Top 0.254: C15.1 -67.15,21.85 -64.22,24.78 U2.52
N$9  (1 unrouted)
N$10
  Top 0.254: U2.1 -55.17,19.67 -53,17.5 R8.2
N$11  (1 unrouted)
N$12
  Top 0.254: U2.7 -54.28,25.78 -53,24.5 -53,20 -51,18 -46.15,18 R32.1
N$16
  Top 0.254: R30.1 -53.15,71.5 -45.5,71.5 LED2.A
N$17
  Top 0.254: R31.1 -53.35,74 -48,74 -47.5,73.5 -44,73.5 -42.5,72 LED3.A
N$28  (1 unrouted)
N$30  (via drill 0.4)
  Top 0.254: U2.14 -52.38,29.28 v-52.2,29.1 | C9.1 v-48.3,29.4
  Bottom 0.254: v-52.2,29.1 -48.6,29.1 v-48.3,29.4
N$31
  Top 0.254: C11.1 -54,38 -54,35.78 U2.27
N$32
  Top 0.254: U2.15 -51.03,29.78 C9.2
N$33
  Top 0.254: U2.13 -53.18,28.78 -52.7,28.3 -51.25,28.3 C8.1
N$34  (1 unrouted)
N$44  (via drill 0.4)  (2 unrouted)
  Top 0.254: -72.5,25.5 v-74,25.5
N$47
  Top 0.254: -62.7,25.5 -62.92,25.28 U2.51 | C15.2 -69,21.65 -69,23.5
  Top 0.305: U2.50 U2.51
  Top 0.61: L1.1 -76.5,21.05 D1.C -74.05,23.5 -69,23.5 -67,23.5 -65,25.5 -62.7,25.5
RO  (via drill 0.35)
  Top 0.254: U1.4 -47.5,53.1 -47.5,41.49 v-49.4,39.6
  Bottom 0.254: IC1.4 -51.09,35.91 -49.21,37.79 -49.21,38.71 -49.23,38.74 -49.23,39.43 v-49.4,39.6
SCL  (via drill 0.35, 0.4)
  Top 0.254: v-59.5,61 R18.1 | v-58,59 -57.8,58.8 -47.89,58.8 v-47.55,58.45 | v-45.7,59.7 -42.3,59.7 -35.5,52.9 U$15.3
  Bottom 0.254: U1.19/A5 -64.26,60.5 -59.5,60.5 | -59.5,60.5 v-59.5,61 | -59.5,60.5 v-58,59 | v-47.55,58.45 -46.95,58.45 v-45.7,59.7
SDA  (via drill 0.4)
  Top 0.254: R17.1 -61.1,61.7 v-61,61.6 -61,60.5 -60.5,60 -55,60 -51,64 -48.5,64 -47,62.5 -47,60 -43,56 U$15.2
  Bottom 0.254: U1.18/A4 -63.62,61.6 v-61,61.6
SN1  (2 unrouted)
SN2  (2 unrouted)
SP1  (2 unrouted)
  Top 0.254: -63.19,34.8 U2.32
SP2  (2 unrouted)
THRO  (via drill 0.35, 0.4)
  Top 0.254: U1.15/A1 -61.5,70.26 C39.1 R26.2 -55.33,65.98 v-53.48,65.98 | U$17.3 -37.2,65.5 -47,65.5 v-48,66.5
  Bottom 0.254: v-48,66.5 -50.5,66.5 -51,66 -53.46,66 v-53.48,65.98
VCC  (via drill 0.35, 0.4)  (1 unrouted)
  Top 0.254: v-62,14.5 -61.5,14 -58,14 -57,15 R3.2 | R17.2 R18.2 -58.95,63.85 -58.6,63.5 -58.6,61.8 v-57.6,60.8 | v-56.6,58.1 -54.8,56.3 v-54.8,53.7 | -51.3,52 v-50.5,51.2
  Top 0.406: v-44.7,51.2 -43.3,49.8 v-34.4,49.8
  Top 0.61: L1.2 -69.6,15.1 C16.1 C27.1 -65.8,14.9 D3.3 -62.4,14.9 v-62,14.5 | U1.VIN -63.84,41.5 C33.1 -62.4,41.8 v-61.1,43.1
  Bottom 0.254: -54,51 -54,51.2 -54.7,51.9 -54.7,53.6 v-54.8,53.7 | v-57.6,60.8 -56.6,59.8 v-56.6,58.1
  Bottom 0.305: -50.1,51.2 -48.2,51.2
  Bottom 0.406: v-61.1,43.1 -56,48.2 -56,49 -54,51 -53.8,51.2 v-50.5,51.2 -50.1,51.2 | -48.2,51.2 v-44.7,51.2 | -33.5,49.7 -33.4,49.8 v-34.4,49.8
  Bottom 0.61: v-62,14.5 -42,14.5 -39,17.5 -39,34 | U$17.2 -38.5,65.5 -38.5,59 U$15.1 -33.5,54 -33.5,49.7 -33.5,42.5 -40,36
VDD  (20 unrouted)
  Top 0.254: R1.2 -77.5,70.5
  Top 0.305: U2.54 U2.53 -62.89,24 | -61.8,36.28 U2.29
  Top 0.406: -61.8,24 -61.8,36.28 -61.8,37.4 -62,37.6 C7.1 | -62.89,24 -61.8,24 | C21.1 -61.8,21.4 -61.8,24
  Top 0.61: C20.1 -60.9,19.55 C21.1
VSENSE
  Top 0.254: U1.14/A0 -64.66,72.5 R2.2 R1.1

### Text on the board
tPlace: Mitsuba Hall Sensor PCB mount test / Designed Feb 22, 2019 by Gerry Chen | 3x hall sensors / 7.5° separation / centered 45° from vertical | Throttle | Throttle | I2C | I2C | L | H | CAN | SEM | Encoder | Encoder
bPlace: Designed by GDC, JP, PLG, AM for / the Shell Eco Marathon | Motor Controller Rev 2.1 / Nov 2018
Reference: 240° / (32 poles) = 7.5° separation